# EAGLE design UTDTestBoxMicro (EAGLE 5.06)
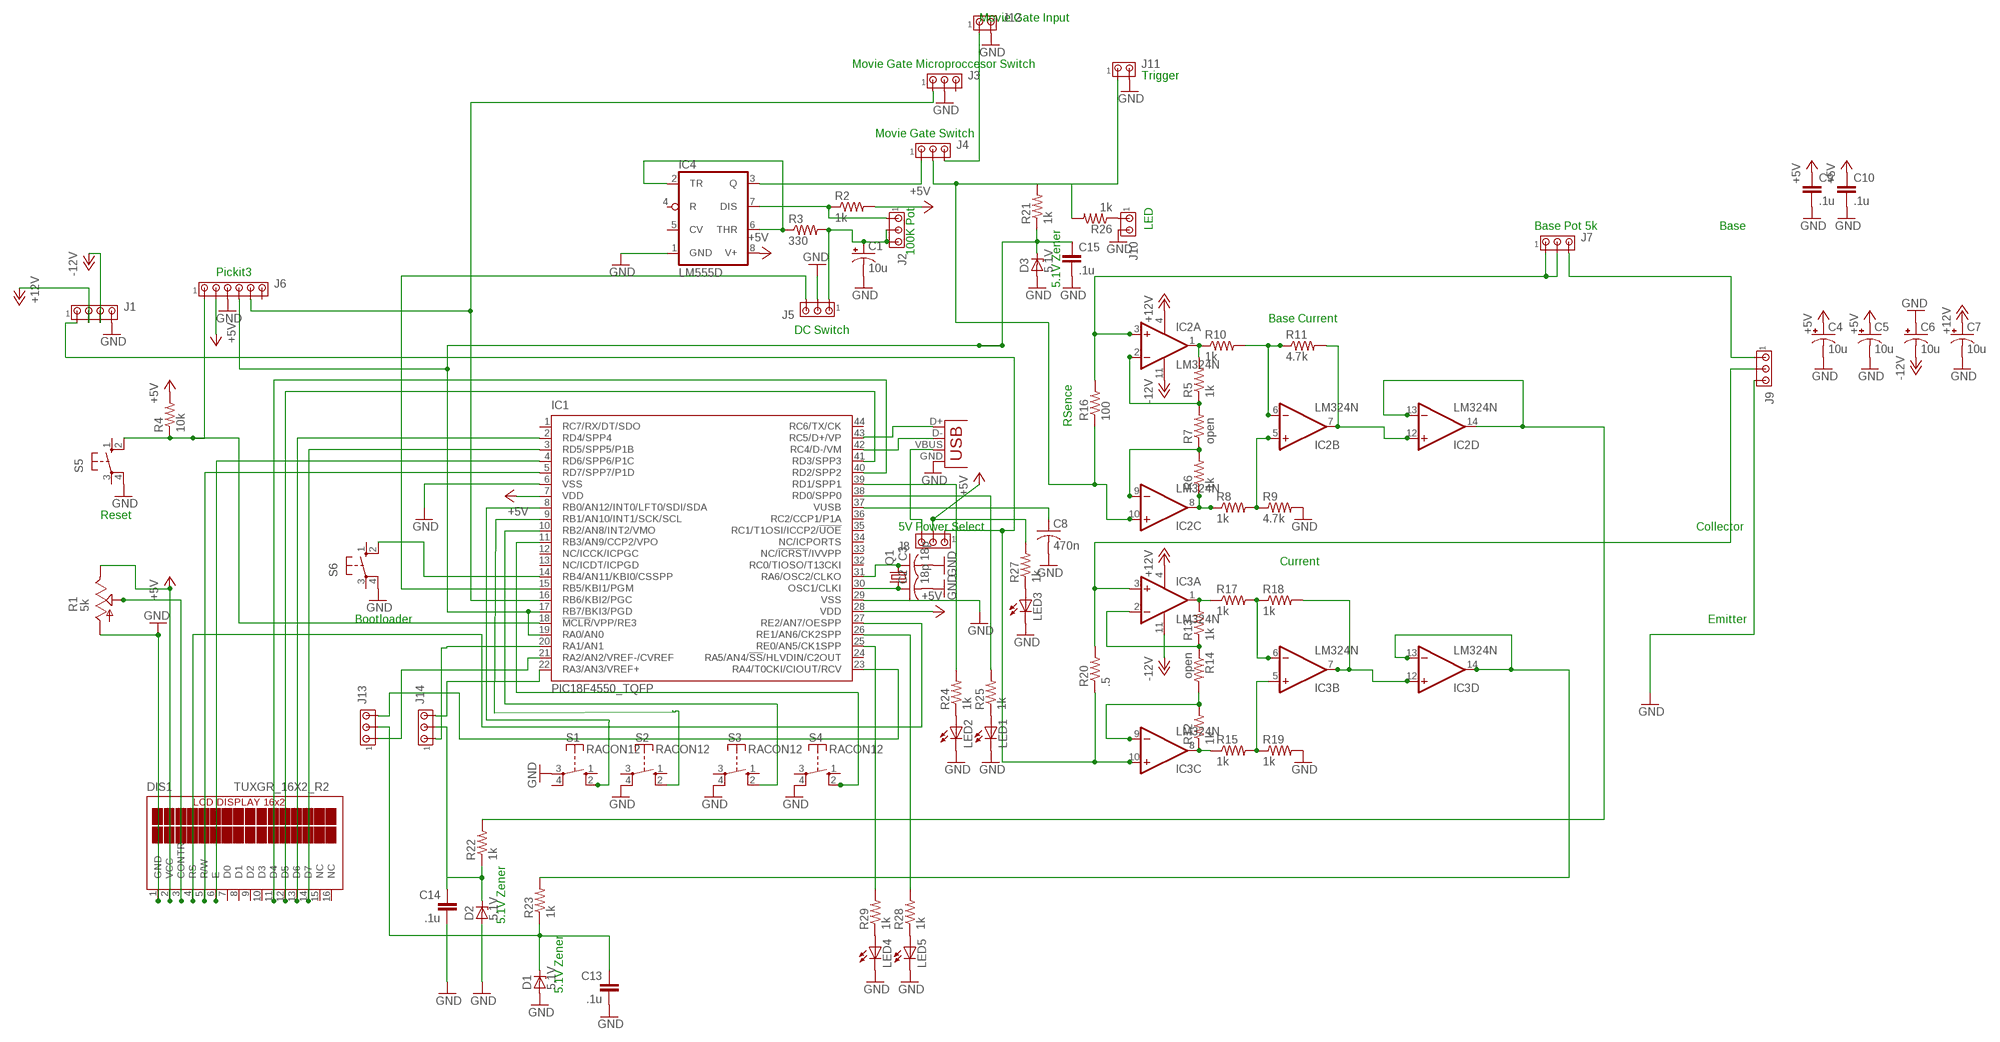
[diagram p0: schematic, sheet 1]

## Parts
C1  10u  CPOL-USE2.5-6  [E2,5-6]
C2  18p  C-USC0805  [C0805]
C3  18p  C-USC0805  [C0805]
C4  10u  CPOL-USE2.5-6  [E2,5-6]
C5  10u  CPOL-USE2.5-6  [E2,5-6]
C6  10u  CPOL-USE2.5-6  [E2,5-6]
C7  10u  CPOL-USE2.5-6  [E2,5-6]
C8  470n  C-USC0805  [C0805]
C9  .1u  C5/3  [C5B3]
C10  .1u  C5/3  [C5B3]
C13  .1u  C5/3  [C5B3]
C14  .1u  C5/3  [C5B3]
C15  .1u  C5/3  [C5B3]
D1  5.1V  ZENER-DIODEDO41Z10  [DO41Z10]
D2  5.1V  ZENER-DIODEDO41Z10  [DO41Z10]
D3  5.1V  ZENER-DIODEDO41Z10  [DO41Z10]
DIS1  TUXGR_16X2_R2  [TUXGR_16X2_R2]
IC1  PIC18F4550_TQFP  [TQFP44]
IC2  LM324N  [DIL14]
IC3  LM324N  [DIL14]
IC4  LM555D  [SO08]
J1  MTA04-156  [1X4MTA]
J2  MTA03-100  [10X03MTA]
J3  MTA03-100  [10X03MTA]
J4  MTA03-100  [10X03MTA]
J5  MTA03-100  [10X03MTA]
J6  MTA06-100  [10X06MTA]
J7  MTA03-100  [10X03MTA]
J8  MTA03-100  [10X03MTA]
J9  MTA03-156  [1X3MTA]
J10  MTA02-100  [10X02MTA]
J11  MTA02-100  [10X02MTA]
J12  MTA02-100  [10X02MTA]
J13  MTA03-100  [10X03MTA]
J14  MTA03-100  [10X03MTA]
LED1  LEDCHIP-LED0805  [CHIP-LED0805]
LED2  LEDCHIP-LED0805  [CHIP-LED0805]
LED3  LEDCHIPLED_0805  [CHIPLED_0805]
LED4  LEDCHIP-LED0805  [CHIP-LED0805]
LED5  LEDCHIP-LED0805  [CHIP-LED0805]
Q1  CRYSTALHC49S  [HC49/S]
R1  5k  TRIM_US-B25U  [B25U]
R2  1k  R-US_R0805  [R0805]
R3  330  R-US_R0805  [R0805]
R4  10k  R-US_M0805  [M0805]
R5  1k  R-US_R0805  [R0805]
R6  1k  R-US_R0805  [R0805]
R7  open  R-US_R0805  [R0805]
R8  1k  R-US_R0805  [R0805]
R9  4.7k  R-US_R0805  [R0805]
R10  1k  R-US_R0805  [R0805]
R11  4.7k  R-US_R0805  [R0805]
R12  1k  R-US_R0805  [R0805]
R13  1k  R-US_R0805  [R0805]
R14  open  R-US_R0805  [R0805]
R15  1k  R-US_R0805  [R0805]
R16  100  R-US_0204/7  [0204/7]
R17  1k  R-US_R0805  [R0805]
R18  1k  R-US_R0805  [R0805]
R19  1k  R-US_R0805  [R0805]
R20  .5  R-US_0204/7  [0204/7]
R21  1k  R-US_R0805  [R0805]
R22  1k  R-US_R0805  [R0805]
R23  1k  R-US_R0805  [R0805]
R24  1k  R-US_R0805  [R0805]
R25  1k  R-US_R0805  [R0805]
R26  1k  R-US_R0805  [R0805]
R27  1k  R-US_R0805  [R0805]
R28  1k  R-US_R0805  [R0805]
R29  1k  R-US_R0805  [R0805]
S1  RACON12  [RACON12]
S2  RACON12  [RACON12]
S3  RACON12  [RACON12]
S4  RACON12  [RACON12]
S5  10-XX  [B3F-10XX]
S6  10-XX  [B3F-10XX]
X1  USBSMD  [USB-MINIB]

## Nets
+5V: C4.+ C5.+ C9.1 C10.1 DIS1.2(VCC) IC1.7(VDD) IC1.28(VDD) IC4.8(V+) J6.5 J8.2 R1.E R2.2 R4.2 R27.2
+12V: C7.+ IC2.4(P:V+) IC3.4(P:V+) J1.2
-12V: C6.- IC2.11(P:V-) IC3.11(P:V-) J1.3
GND: C1.- C2.2 C3.2 C4.- C5.- C6.+ C7.- C8.2 C9.2 C10.2 C13.2 C14.2 C15.2 D1.A D2.A D3.A DIS1.1(GND) IC1.6(VSS) IC1.29(VSS) IC4.1(GND) J1.4 J3.2 J5.2 J6.4 J9.3 J10.2 J11.2 J12.2 LED1.C LED2.C LED3.C LED4.C LED5.C R1.A R9.2 R19.2 S1.3(P) S2.4(P) S3.4(P) S4.4(P) S5.4(P1) S6.4(P1) X1.GND
N$1: DIS1.3(CONTR) R1.S
N$2: IC1.8(RB0/AN12/INT0/LFT0/SDI/SDA) S1.2(S)
N$3: DIS1.4(RS) IC1.27(RE2/AN7/OESPP)
N$4: DIS1.5(R/W) IC1.5(RD7/SPP7/P1D)
N$5: DIS1.6(E) IC1.4(RD6/SPP6/P1C)
N$6: DIS1.14(D7) IC1.3(RD5/SPP5/P1B)
N$7: DIS1.13(D6) IC1.2(RD4/SPP4)
N$8: DIS1.12(D5) IC1.41(RD3/SPP3)
N$9: DIS1.11(D4) IC1.40(RD2/SPP2)
N$10: IC1.9(RB1/AN10/INT1/SCK/SCL) S2.2(S)
N$11: IC1.10(RB2/AN8/INT2/VMO) S3.2(S)
N$12: IC1.11(RB3/AN9/CCP2/VPO) S4.2(S)
N$13: IC4.2(TR) IC4.6(THR) R3.1
N$14: IC4.3(Q) J4.1
N$15: IC4.7(DIS) J2.1 R2.1
N$16: C1.+ J2.2 J2.3 J5.1 R3.2
N$17: C15.1 D3.C IC1.17(RB7/BKI3/PGD) IC1.19(RA0/AN0) J6.3 R21.1
N$18: IC2.8(C:OUT) R6.1 R8.1
N$19: J4.3 J12.1
N$20: IC1.16(RB6/KBI2/PGC) J3.1 J6.2
N$21: IC1.15(RB5/KBI1/PGM) J5.3
N$22: IC1.14(RB4/AN11/KBI0/CSSPP) S6.2(S1)
N$23: IC1.18(!MCLR!/VPP/RE3) J6.6 R4.1 S5.2(S1)
N$24: IC3.8(C:OUT) R12.1 R15.1
N$25: IC2.2(A:-IN) R5.1 R7.2
N$26: IC2.1(A:OUT) R5.2 R10.1
N$27: IC3.1(A:OUT) R13.2 R17.1
N$28: IC3.2(A:-IN) R13.1 R14.1
N$29: C13.1 D1.C J13.2 R23.1
N$30: IC2.9(C:-IN) R6.2 R7.1
N$31: IC2.5(B:+IN) R8.2 R9.1
N$32: IC2.6(B:-IN) R10.2 R11.1
N$33: IC2.7(B:OUT) IC2.12(D:+IN) R11.2
N$34: IC2.13(D:-IN) IC2.14(D:OUT) R22.2
N$35: IC2.3(A:+IN) J7.1 J7.2 R16.2
N$36: J7.3 J9.1
N$37: IC3.10(C:+IN) J1.1 J8.1 R20.1
N$38: IC3.9(C:-IN) R12.2 R14.2
N$39: IC1.20(RA1/AN1) J14.1
N$40: IC3.3(A:+IN) J9.2 R20.2
N$41: IC3.5(B:+IN) R15.2 R19.1
N$42: IC3.6(B:-IN) R17.2 R18.1
N$43: IC3.7(B:OUT) IC3.12(D:+IN) R18.2
N$44: IC3.13(D:-IN) IC3.14(D:OUT) R23.2
N$45: IC1.39(RD1/SPP1) R24.2
N$46: IC2.10(C:+IN) J4.2 J11.1 R16.1 R21.2 R26.2
N$47: IC1.42(RC4/D-/VM) X1.D-
N$48: IC1.43(RC5/D+/VP) X1.D+
N$49: J8.3 X1.VBUS
N$50: IC1.38(RD0/SPP0) R25.2
N$52: LED1.A R25.1
N$53: LED2.A R24.1
N$54: LED3.A R27.1
N$55: LED5.A R28.1
N$56: LED4.A R29.1
N$57: IC1.25(RE0/AN5/CK1SPP) R29.2
N$58: IC1.26(RE1/AN6/CK2SPP) R28.2
N$59: C2.1 IC1.30(OSC1/CLKI) Q1.1
N$60: C3.1 IC1.31(RA6/OSC2/CLKO) Q1.2
N$61: J10.1 R26.1
N$62: C8.1 IC1.37(VUSB)
N$65: IC1.21(RA2/AN2/VREF-/CVREF) J13.1
N$66: IC1.23(RA4/T0CKI/CIOUT/RCV) J13.3
N$67: C14.1 D2.C J14.2 R22.1
N$69: IC1.22(RA3/AN3/VREF+) J14.3
Unconnected: DIS1.7(D0) DIS1.8(D1) DIS1.9(D2) DIS1.10(D3) DIS1.15(NC) DIS1.16(NC) IC1.1(RC7/RX/DT/SDO) IC1.12(NC/ICCK/ICPGC) IC1.13(NC/ICDT/ICPGD) IC1.24(RA5/AN4/!SS!/HLVDIN/C2OUT) IC1.32(RC0/TIOSO/T13CKI) IC1.33(NC/!ICRST!/IVVPP) IC1.34(NC/ICPORTS) IC1.35(RC1/T1OSI/ICCP2/!UOE) IC1.36(RC2/CCP1/P1A) IC1.44(RC6/TX/CK) IC4.4(R) IC4.5(CV) J3.3 J6.1 S1.1(S) S1.4(P) S2.1(S) S2.3(P) S3.1(S) S3.3(P) S4.1(S) S4.3(P) S5.1(S) S5.3(P) S6.1(S) S6.3(P)

## Notes on the sheet
- Movie Gate Input
- Movie Gate Microproccesor Switch
- Trigger
- Movie Gate Switch
- LED | Base Pot 5k | Base
- 100K Pot
- Pickit3
- 5.1V Zener
- Base Current
- DC Switch
- RSence
- Reset
- 5V Power Select | Collector
- Current
- Bootloader | Emitter
- 5.1V Zener
- 5.1V Zener

## Library data of the parts
C1 C4-C7 = resistor:CPOL-US: POLARIZED CAPACITOR, American symbol
C2 C3 C8 = resistor:C-US: CAPACITOR, American symbol
C9 C10 C13-C15 = capacitor-wima:C: CAPACITOR naming: grid - package width
D1-D3 = diode:ZENER-DIODE: Z-Diode
DIS1 = display-lcd:TUXGR_16X2_R2: Tuxgraphics LCD display 16x2 characters reflective, without background light Source: tuxgr_12x2_r2.pdf
IC1 = microchip:PIC18F4*_TQFP: USB Microcontrollers with nanoWatt Technology High-Performance, Enhanced Flash, 28/40/44-Pin, Source: http://ww1.microchip.com/downloads/en/devicedoc/39632c.pdf
IC2 IC3 = linear:LM324: OP AMP
IC4 = linear:*555: TIMER
J1 = con-amp:MTA04-156: AMP connector
J2-J5 J7 J8 J13 J14 = con-amp:MTA03-100: AMP connector
J6 = con-amp:MTA06-100: AMP connector
J9 = con-amp:MTA03-156: AMP connector
J10-J12 = con-amp:MTA02-100: AMP connector
LED1-LED5 = led:LED: LED OSRAM: - CHIPLED LG R971, LG N971, LY N971, LG Q971, LY Q971, LO R971, LY R971 LH N974, LH R974 LS Q976, LO Q976, LY Q976 LO Q996 - Hyper CHIPLED LW Q18S LB Q993, LB Q99A, LB R99A - SideLED LS A670, LO A670, LY A670, LG A670, LP A670 LB A673, LV A673, LT A673, LW A673 LH A674 LY A675 LS A676, LA A676, LO A676, LY A676, LW A676 LS A679, LY A679, LG A679 - Hyper Micro SIDELED® LS Y876, LA Y876, LO Y876, LY Y876 LT Y87S - SmartLED LW L88C, LW L88S LB L89C, LB L89S, LG L890 LS L89K, LO L89K, LY L89K LS L896, LA L896, LO L896, LY L896 - TOPLED LS T670, LO T670, LY T670, LG T670, LP T670 LSG T670, LSP T670, LSY T670, LOP T670, LYG T670 LG T671, LOG T671, LSG T671 LB T673, LV T673, LT T673, LW T673 LH T674 LS T676, LA T676, LO T676, LY T676, LB T676, LH T676, LSB T676, LW T676 LB T67C, LV T67C, LT T67C, LS T67K, LO T67K, LY T67K, LW E67C LS E67B, LA E67B, LO E67B, LY E67B, LB E67C, LV E67C, LT E67C LW T67C LS T679, LY T679, LG T679 LS T770, LO T770, LY T770, LG T770, LP T770 LB T773, LV T773, LT T773, LW T773 LH T774 LS E675, LA E675, LY E675, LS T675 LS T776, LA T776, LO T776, LY T776, LB T776 LHGB T686 LT T68C, LB T68C - Hyper Mini TOPLED® LB M676 - Mini TOPLED Santana® LG M470 LS M47K, LO M47K, LY M47K Source: http://www.osram.convergy.de LUXEON: - LUMILED® LXK2-PW12-R00, LXK2-PW12-S00, LXK2-PW14-U00, LXK2-PW14-V00 LXK2-PM12-R00, LXK2-PM12-S00, LXK2-PM14-U00 LXK2-PE12-Q00, LXK2-PE12-R00, LXK2-PE12-S00, LXK2-PE14-T00, LXK2-PE14-U00 LXK2-PB12-K00, LXK2-PB12-L00, LXK2-PB12-M00, LXK2-PB14-N00, LXK2-PB14-P00, LXK2-PB14-Q00 LXK2-PR12-L00, LXK2-PR12-M00, LXK2-PR14-Q00, LXK2-PR14-R00 LXK2-PD12-Q00, LXK2-PD12-R00, LXK2-PD12-S00 LXK2-PH12-R00, LXK2-PH12-S00 LXK2-PL12-P00, LXK2-PL12-Q00, LXK2-PL12-R00 Source: www.luxeon.com KINGBRIGHT: KA-3528ASYC Source: www.kingbright.com
Q1 = crystal:CRYSTAL: CRYSTAL
R1 = pot:TRIM_US-: POTENTIOMETER
R2-R29 = resistor:R-US_: RESISTOR, American symbol
S1-S4 = switch-misc:RACON12: ITT SWITCH
S5 S6 = switch-omron:10-XX: OMRON SWITCH
X1 = SparkFun:USB: USB Connectors USB-B-PTH is fully proven SKU : PRT-00139 USB-miniB is fully proven SKU : PRT-00587 USB-A-PCB is untested. USB-A-H is throughly reviewed, but untested. Spark Fun Electronics SKU : PRT-00437 USB-B-SMT is throughly reviewed, but untested. Needs silkscreen touching up. USB-A-S has not been used/tested USB-MB-H has not been used/tested

## Board
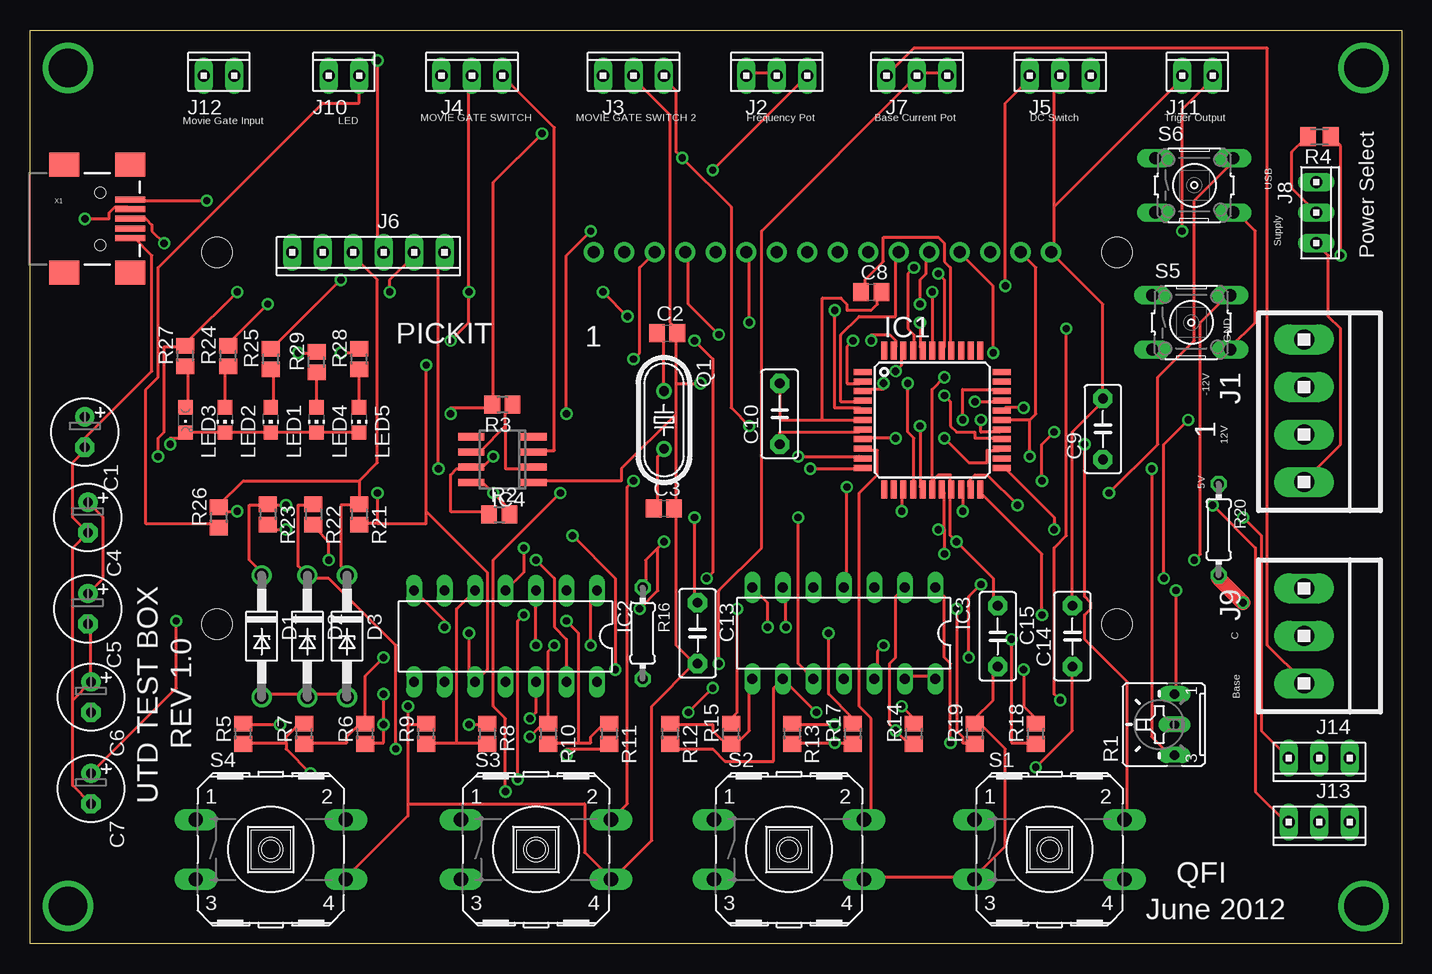
[diagram p1: board, top side]
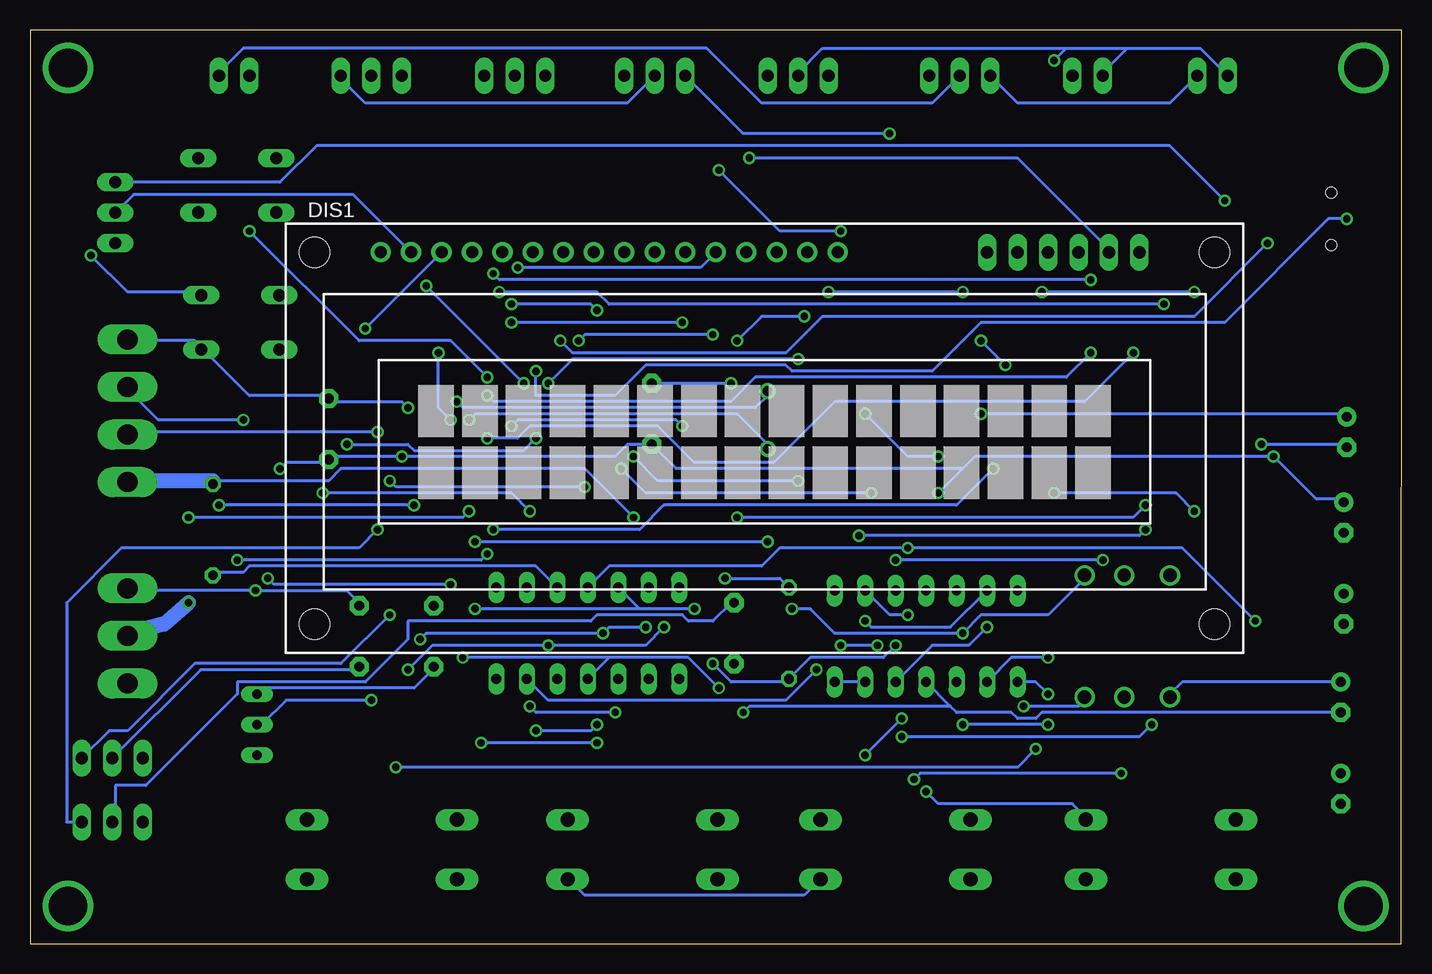
[diagram p2: board, bottom side, seen from below]

Size 114.3 x 76.2 mm. Coordinates in mm from the lower left corner, seen from the top.
Outline: 114.3,0 0.02,0 0,76.2 114.3,76.2 114.3,0
Copper layers (1*16): Top 0.035mm / dielectric 1.5mm / Bottom 0.035mm
Design rules "default": minimum track width 10mil, minimum drill 24mil, track to track 8mil, track to pad 8mil, pad to pad 8mil, via to via 8mil, smd to smd 8mil, copper to edge 40mil, drill to drill 8mil, minimum pad ring 10mil, minimum via ring 8mil, stop-mask expansion 4mil, vias tented up to drill 0mil, thermal gap 10mil

### Footprints (pad centres in the part's own frame; a part is rotated, then mirrored left to right if it is on the bottom)
E2,5-6 = drill 0.813 pad 1.6 round: + -1.27,0 | drill 0.813 pad 1.6 octagon: - 1.27,0
C0805 = smd 1.3 x 1.5: 1 -0.85,0; 2 0.85,0
C5B3 = drill 0.813 pad 1.6 octagon: 1 -2.54,0; 2 2.54,0
DO41Z10 = drill 1.118 round: A 5.08,0; C -5.08,0
TUXGR_16X2_R2 = drill 1 pad 1.676 round: 1 -32,15.5; 2 -29.46,15.5; 3 -26.92,15.5; 4 -24.38,15.5; 5 -21.84,15.5; 6 -19.3,15.5; 7 -16.76,15.5; 8 -14.22,15.5; 9 -11.68,15.5; 10 -9.14,15.5; 11 -6.6,15.5; 12 -4.06,15.5; 13 -1.52,15.5; 14 1.02,15.5; 15 3.56,15.5; 16 6.1,15.5 | hole 2.5: -37.5,-15.5; 37.5,-15.5; -37.5,15.5; 37.5,15.5
TQFP44 = smd 1.5 x 0.5: 1 -5.8,4; 2 -5.8,3.2; 3 -5.8,2.4; 4 -5.8,1.6; 5 -5.8,0.8; 6 -5.8,0; 7 -5.8,-0.8; 8 -5.8,-1.6; 9 -5.8,-2.4; 10 -5.8,-3.2; 11 -5.8,-4; 23 5.8,-4; 24 5.8,-3.2; 25 5.8,-2.4; 26 5.8,-1.6; 27 5.8,-0.8; 28 5.8,0; 29 5.8,0.8; 30 5.8,1.6; 31 5.8,2.4; 32 5.8,3.2; 33 5.8,4 | smd 0.5 x 1.5: 12 -4,-5.8; 13 -3.2,-5.8; 14 -2.4,-5.8; 15 -1.6,-5.8; 16 -0.8,-5.8; 17 0,-5.8; 18 0.8,-5.8; 19 1.6,-5.8; 20 2.4,-5.8; 21 3.2,-5.8; 22 4,-5.8; 34 4,5.8; 35 3.2,5.8; 36 2.4,5.8; 37 1.6,5.8; 38 0.8,5.8; 39 0,5.8; 40 -0.8,5.8; 41 -1.6,5.8; 42 -2.4,5.8; 43 -3.2,5.8; 44 -4,5.8
DIL14 = drill 0.813 long: 1 -7.62,-3.81; 2 -5.08,-3.81; 3 -2.54,-3.81; 4 0,-3.81; 5 2.54,-3.81; 6 5.08,-3.81; 7 7.62,-3.81; 8 7.62,3.81; 9 5.08,3.81; 10 2.54,3.81; 11 0,3.81; 12 -2.54,3.81; 13 -5.08,3.81; 14 -7.62,3.81
SO08 = smd 0.6 x 2.2: 1 -1.905,-2.6; 2 -0.635,-2.6; 3 0.635,-2.6; 4 1.905,-2.6; 5 1.905,2.6; 6 0.635,2.6; 7 -0.635,2.6; 8 -1.905,2.6
1X4MTA = drill 1.676 long: 1 5.944,0; 2 1.981,0; 3 -1.981,0; 4 -5.944,0
10X03MTA = drill 1.016 long: 1 2.54,0; 2 0,0; 3 -2.54,0
10X06MTA = drill 1.016 long: 1 6.35,0; 2 3.81,0; 3 1.27,0; 4 -1.27,0; 5 -3.81,0; 6 -6.35,0
1X3MTA = drill 1.676 long: 1 3.937,0; 2 -0.025,0; 3 -3.988,0
10X02MTA = drill 1.016 long: 1 1.27,0; 2 -1.27,0
CHIP-LED0805 = smd 1.2 x 1.2: A 0,-1.05; C 0,1.05
CHIPLED_0805 = smd 1.2 x 1.2: A 0,-1.05; C 0,1.05
HC49/S = drill 0.813 round: 1 -2.413,0; 2 2.413,0
B25U = drill 0.813 long: A 2.54,-0.889; E -2.54,-0.889; S 0,-0.889
R0805 = smd 1.3 x 1.5: 1 -0.85,0; 2 0.85,0
M0805 = smd 1.3 x 1.6: 1 -0.95,0; 2 0.95,0
0204/7 = drill 0.813 octagon: 1 -3.81,0; 2 3.81,0
RACON12 = drill 1.194 long: 1 -6.248,2.489; 2 6.248,2.489; 3 -6.248,-2.489; 4 6.248,-2.489
B3F-10XX = drill 1.016 long: 1 -3.251,2.261; 2 3.251,2.261; 3 -3.251,-2.261; 4 3.251,-2.261
USB-MINIB = smd 2.5 x 0.5: D+ 2.5,0; D- 2.5,0.8; GND 2.5,-1.6; ID 2.5,-0.8; VBUS 2.5,1.6 | smd 2.5 x 2: MTN1 -3,4.5; MTN2 2.5,4.5; MTN3 -3,-4.5; MTN4 2.5,-4.5 | hole 0.9: 0,2.2; 0,-2.2

### Placement (x,y rotation side)
C1  4.57,42.67 270 top
C2  53.09,50.93 0 top
C3  52.83,36.32 0 top
C4  4.83,35.56 270 top
C5  4.83,27.94 270 top
C6  5.08,20.57 270 top
C7  5.08,12.95 270 top
C8  70.1,54.36 0 top
C9  89.41,42.93 90 top
C10  62.48,44.2 90 top
C13  55.63,25.91 270 top
C14  86.87,25.65 90 top
C15  80.64,25.65 270 top
D1  19.3,25.65 270 top
D2  23.11,25.65 270 top
D3  26.42,25.65 270 top
DIS1  53.09,42.16 0 bottom
IC1  75.18,43.69 0 top
IC2  39.62,25.65 180 top
IC3  67.82,25.91 180 top
IC4  39.37,40.39 90 top
J1  106.17,44.45 270 top
J2  62.23,72.39 0 top
J3  50.29,72.39 0 top
J4  36.83,72.39 0 top
J5  85.85,72.39 0 top
J6  28.19,57.66 180 top
J7  73.91,72.39 0 top
J8  107.19,60.96 270 top
J9  106.17,25.65 270 top
J10  26.16,72.39 0 top
J11  97.28,72.39 0 top
J12  15.75,72.39 0 top
J13  107.44,10.16 180 top
J14  107.44,15.49 180 top
LED1  20.07,43.69 180 top
LED2  16.26,43.69 180 top
LED3  12.95,43.69 180 top
LED4  23.88,43.69 180 top
LED5  27.43,43.69 180 top
Q1  52.83,43.69 270 top
R1  94.49,18.29 90 top
R2  39.12,35.81 0 top
R3  39.37,44.96 180 top
R4  107.44,67.31 180 top
R5  17.78,17.53 90 top
R6  27.94,17.53 90 top
R7  22.86,17.53 90 top
R8  38.1,17.53 270 top
R9  33.02,17.53 90 top
R10  43.18,17.53 270 top
R11  48.26,17.53 270 top
R12  53.34,17.53 270 top
R13  63.5,17.53 270 top
R14  73.66,17.53 90 top
R15  58.42,17.53 90 top
R16  51.05,25.91 270 top
R17  68.58,17.53 90 top
R18  83.82,17.53 90 top
R19  78.74,17.53 90 top
R20  99.06,34.54 270 top
R21  27.43,35.81 270 top
R22  23.62,35.81 270 top
R23  19.81,35.81 270 top
R24  16.51,49.02 90 top
R25  20.07,48.77 90 top
R26  15.75,35.56 90 top
R27  12.95,49.02 90 top
R28  27.43,48.77 90 top
R29  23.88,48.51 90 top
S1  84.96,7.87 0 top
S2  63.25,7.87 0 top
S3  42.16,7.87 0 top
S4  20.07,7.87 0 top
S5  96.77,51.82 0 top
S6  97.03,63.25 0 top
X1  5.84,60.45 0 top

### Tracks (layer width: path | path; a pad name or v marks a point on that pad's centre or on a via)
+5V  (via drill 0.61)
  Top 0.254: J8.2 105.16,62.99 105.16,66.04 106.17,67.06 R4.2 | v83.31,40.64 83.31,43.69 | 83.31,43.69 IC1.28 | v93.47,39.62 93.47,17.27 95,15.75 R1.E | 83.31,43.69 83.82,44.2 83.82,56.39 82.8,57.4 DIS1.2 | C10.1 62.48,42.67 69.09,42.67 IC1.7 | R2.2 39.62,36.07 39.62,36.58 v38.61,37.59 37.59,38.61 37.08,38.61 IC4.8 | v10.67,40.64 10.67,42.16 11.18,42.67 11.18,49.78 12.7,49.78 R27.2 13.21,50.29 v17.27,54.36 | v29.97,54.36 29.97,55.37 32,57.4 J6.5 | C5.+ 6.1,30.48 6.1,35.56 C4.+
  Bottom 0.254: v93.47,39.62 92.96,40.13 89.41,40.13 C9.1 89.41,40.64 v83.31,40.64 65.53,40.64 64.52,41.66 C10.1 60.45,39.62 36.58,39.62 | J8.2 105.66,62.48 87.38,62.48 82.8,57.91 DIS1.2 | C4.+ 5.08,37.08 7.11,37.08 v10.67,40.64 35.56,40.64 36.58,39.62 | v17.27,54.36 v29.97,54.36 | 36.58,39.62 v38.61,37.59
+12V  (via drill 0.61)
  Top 0.254: IC2.4 41.15,30.99 v41.15,33.02 | C7.+ 12.19,21.34 v12.19,26.92 | v85.34,42.67 84.33,41.66 v84.33,38.61 | v68.07,38.1 68.07,29.97 IC3.4
  Bottom 0.254: IC3.4 66.04,31.5 53.34,31.5 51.82,33.02 v41.15,33.02 18.29,33.02 v12.19,26.92 | v85.34,42.67 106.17,42.67 J1.2 | v84.33,38.61 83.82,38.1 v68.07,38.1
-12V  (via drill 0.61)
  Top 0.254: v54.86,19.3 v56.9,21.34 | v96.52,43.69 94.49,41.66 v94.49,30.48 | v79.25,29.97 78.23,28.96 v78.23,23.88
  Bottom 0.254: 37.59,19.81 37.08,19.3 32.51,19.3 32,18.8 30.48,18.8 29.97,19.3 C6.- | 37.59,19.81 IC2.11 | 66.04,23.88 59.44,23.88 v56.9,21.34 | v54.86,19.3 54.36,19.81 37.59,19.81 | 66.04,23.88 IC3.11 | v96.52,43.69 103.63,43.69 106.17,46.23 J1.3 | v94.49,30.48 93.98,29.97 v79.25,29.97 | 66.04,23.88 v78.23,23.88
GND  (via drill 0.61)
  Top 0.254: S2.4 69.6,5.59 78.23,5.59 S1.3 78.74,5.59 81.28,8.13 81.28,16.26 78.74,18.8 | 78.74,18.8 80.26,20.32 80.26,22.86 C15.2 | 78.74,18.8 R19.2 | 85.34,61.47 85.34,57.91 DIS1.1 85.34,57.4 89.41,53.34 C9.2 89.41,45.21 86.87,42.67 C14.2 | 85.34,61.47 85.34,71.63 85.85,72.14 J5.2 | 85.34,61.47 96.01,72.14 J11.2 | S6.4 100.58,60.96 102.11,59.44 102.11,51.82 100.08,49.78 S5.4 | v82.8,44.7 81.28,44.7 IC1.29 | v95.5,29.46 95.5,20.83 R1.A | 16.26,42.67 13.21,42.67 LED3.C 12.7,42.16 11.68,42.16 v11.68,41.66 | 23.88,42.67 20.32,42.67 LED1.C 19.81,42.67 16.26,42.67 | 23.88,42.67 27.43,42.67 LED5.C | 23.88,42.67 LED4.C | 16.26,42.67 LED2.C | X1.GND 8.64,58.93 10.16,57.4 10.16,47.75 4.57,42.16 C1.- 4.57,41.15 3.56,40.13 3.56,35.56 C4.- 3.56,33.02 3.56,20.32 | 31.5,18.29 33.02,18.29 R9.2 | 31.5,11.68 31.5,10.67 26.42,5.59 S4.4 | 31.5,18.29 31.5,11.68 | D1.A 19.3,20.83 22.86,20.83 D2.A 23.37,20.83 26.42,20.83 D3.A | C7.- 3.56,13.21 3.56,20.32 | 3.56,20.32 C6.+ 5.08,26.42 C5.- | v31.5,19.81 31.5,18.29 | v28.96,73.66 28.96,58.42 29.46,57.91 J6.4 | 66.04,43.69 62.48,43.69 C10.2 | 66.04,43.69 IC1.6 | 66.04,43.69 66.04,53.85 67.56,53.85 68.07,53.34 68.07,52.83 70.1,52.83 70.61,53.34 70.61,54.36 C8.2 | 53.85,46.74 53.85,50.8 C2.2 53.85,51.31 53.34,51.82 53.34,69.09 50.29,72.14 J3.2 | 53.85,44.2 53.85,46.74 | 53.85,44.2 53.85,36.58 C3.2 53.85,36.07 53.85,24.89 55.37,23.37 | 53.85,44.2 49.28,39.62 49.28,38.61 42.16,38.61 IC4.1 | 55.37,23.37 51.82,19.81 51.82,8.64 48.77,5.59 S3.4 48.26,5.59 46.23,7.62 46.23,11.68 31.5,11.68 | 55.37,23.37 C13.2 | 53.85,46.74 v55.88,46.74
  Bottom 0.254: R1.A 95,20.83 94.49,21.34 82.3,21.34 80.77,22.86 C15.2 | J1.4 106.17,50.29 100.58,50.29 100.08,49.78 S5.4 99.57,49.28 96.01,45.72 89.41,45.72 C9.2 89.41,45.21 83.31,45.21 v82.8,44.7 | C14.2 86.87,28.45 87.88,29.46 v95.5,29.46 106.17,29.46 J9.3 | v11.68,41.66 4.57,41.66 C1.- | C6.+ 18.29,21.84 19.3,20.83 D1.A | v31.5,19.81 26.92,19.81 26.42,20.32 D3.A | 22.86,74.68 16.76,74.68 J12.2 | 22.86,74.68 24.89,72.64 J10.2 | 27.94,74.68 v28.96,73.66 | 27.94,74.68 22.86,74.68 | 27.94,74.68 48.26,74.68 50.29,72.64 J3.2 | v55.88,46.74 C10.2 | S2.4 69.09,5.08 68.07,4.06 49.78,4.06 48.77,5.08 S3.4
N$1  (via drill 0.61)
  Top 0.254: v85.85,20.32 85.34,20.83 85.34,33.02 86.36,34.04 v86.36,51.31
  Bottom 0.254: v85.85,20.32 92.96,20.32 95,18.29 R1.S | v86.36,51.31 80.26,57.4 DIS1.3
N$2  (via drill 0.61)
  Top 0.254: v72.14,42.16 69.6,42.16 IC1.8 | v87.88,41.66 87.88,28.96 88.39,28.45 88.39,27.94 87.88,27.43 87.88,25.4 91.44,21.84 91.44,10.67 S1.2
  Bottom 0.254: v72.14,42.16 73.15,41.15 82.3,41.15 82.8,41.66 v87.88,41.66
N$3  (via drill 0.61)
  Top 0.254: v79.25,43.69 79.25,42.67 80.77,42.67 IC1.27 | v80.26,49.28 80.26,54.86 77.72,57.4 DIS1.4
  Bottom 0.254: v79.25,43.69 80.26,44.7 v80.26,49.28
N$4  (via drill 0.61)
  Top 0.254: v67.06,52.83 67.06,44.7 69.09,44.7 IC1.5 | v74.17,53.34 74.17,55.37 74.68,55.88 74.68,57.4 DIS1.5
  Bottom 0.254: v67.06,52.83 67.56,53.34 v74.17,53.34
N$5
  Top 0.254: IC1.4 69.09,45.21 67.56,45.21 67.56,50.8 69.09,52.32 72.14,52.32 72.14,57.4 DIS1.6
N$6  (via drill 0.61)
  Top 0.254: v71.12,46.74 71.12,46.23 69.6,46.23 IC1.3 | v50.29,48.77 50.8,49.28 50.8,56.39 51.82,57.4 DIS1.14
  Bottom 0.254: v71.12,46.74 69.09,48.77 v50.29,48.77
N$7  (via drill 0.61)
  Top 0.254: v68.58,50.29 68.07,49.78 68.07,46.74 69.09,46.74 IC1.2 | v57.4,50.8 54.86,53.34 54.86,57.4 DIS1.13
  Bottom 0.254: v68.58,50.29 68.07,50.8 v57.4,50.8
N$8  (via drill 0.61)
  Top 0.254: v73.66,56.39 73.15,55.88 73.15,51.31 73.66,50.8 73.66,49.78 IC1.41
  Bottom 0.254: v73.66,56.39 58.42,56.39 57.4,57.4 DIS1.12
N$9  (via drill 0.61)
  Top 0.254: v74.17,51.82 74.17,49.78 IC1.40 | v59.94,51.82 59.94,57.4 DIS1.11
  Bottom 0.254: v59.94,51.82 v74.17,51.82
N$10
  Top 0.254: IC1.9 69.6,41.15 70.61,41.15 70.61,39.12 69.09,37.59 69.09,19.81 70.1,18.8 70.1,11.18 69.6,10.67 S2.2
N$11  (via drill 0.61)
  Top 0.254: v64.01,40.64 69.09,40.64 IC1.10 | v50.29,38.61 49.78,38.1 49.78,11.68 48.77,10.67 S3.2
  Bottom 0.254: v64.01,40.64 61.98,38.61 v50.29,38.61
N$12  (via drill 0.61)
  Top 0.254: v65.02,39.62 69.09,39.62 IC1.11 | v44.2,37.59 38.61,32 38.61,19.81 39.62,18.8 v39.62,12.7
  Bottom 0.254: v65.02,39.62 62.99,37.59 v44.2,37.59 | v39.62,12.7 38.61,11.68 27.43,11.68 26.42,10.67 S4.2
N$13
  Top 0.254: 39.62,43.18 39.62,44.2 40.13,44.7 R3.1 | 39.62,43.18 37.59,41.15 37.08,41.15 IC4.6 | 39.62,43.18 39.62,39.62 41.66,39.62 IC4.2
N$14
  Top 0.254: IC4.3 42.16,41.15 43.69,41.15 43.69,68.07 J4.1
N$15  (via drill 0.61)
  Top 0.254: R2.1 38.1,36.07 35.05,36.07 35.05,39.12 35.56,39.62 36.58,39.62 IC4.7 37.08,39.62 37.59,39.62 v38.61,40.64 | v46.74,59.44 44.7,57.4 v44.7,44.2 | v56.9,64.52 J2.1
  Bottom 0.254: v56.9,64.52 51.82,59.44 v46.74,59.44 | v44.7,44.2 41.15,40.64 v38.61,40.64
N$16  (via drill 0.61)
  Top 0.254: J2.3 59.94,72.64 61.98,72.64 J2.2 | v35.05,44.2 35.05,44.7 38.1,44.7 R3.2 38.61,45.21 38.61,63.5 v42.67,67.56
  Bottom 0.254: J5.1 88.39,72.14 86.36,70.1 64.52,70.1 J2.2 | v35.05,44.2 4.57,44.2 C1.+ | v42.67,67.56 54.86,67.56 J2.3
N$17  (via drill 0.61)
  Top 0.254: 75.18,38.61 75.69,39.12 76.71,39.12 76.71,38.1 IC1.19 76.71,37.59 76.71,34.04 v77.22,33.53 80.26,30.48 80.26,28.45 C15.1 | 98.55,72.14 96.01,69.6 v96.01,59.44 | v76.2,47.24 75.18,46.23 75.18,38.61 | 75.18,38.61 IC1.17 | 15.75,36.58 17.78,38.61 27.43,38.61 | 27.43,38.61 R21.1 27.43,36.58 25.91,36.58 25.91,31.5 26.42,30.99 D3.C | 27.43,38.61 28.96,40.13 28.96,55.37 26.92,57.4 J6.3 | v36.58,25.91 36.58,22.35 | 52.32,33.02 51.31,32 51.31,29.97 | 52.32,33.02 v52.83,33.53 | v50.8,27.94 52.32,29.46 52.32,33.02
  Bottom 0.254: v96.01,59.44 86.87,50.29 79.25,50.29 v76.2,47.24 | D3.C 26.42,30.48 29.46,27.43 35.05,27.43 v36.58,25.91 47.24,25.91 49.28,27.94 v50.8,27.94 | v52.83,33.53 v77.22,33.53
N$18  (via drill 0.61)
  Top 0.254: v29.46,20.83 v29.46,18.29 29.46,16.76 27.94,16.76 R6.1 | v36.58,18.29 38.1,18.29 R8.1
  Bottom 0.254: v29.46,20.83 30.48,21.84 IC2.8 | v29.46,18.29 v36.58,18.29
N$19
  Bottom 0.254: J12.1 19.3,70.1 32,70.1 J4.3
N$20  (via drill 0.61)
  Top 0.254: v74.17,43.18 74.17,38.1 IC1.16 | v59.94,43.18 58.42,44.7 58.42,61.47 v54.36,65.53 53.85,66.04 53.85,71.12 52.83,72.14 J3.1
  Bottom 0.254: v74.17,43.18 73.66,43.69 60.45,43.69 v59.94,43.18 | v54.36,65.53 32,65.53 24.38,57.91 J6.2
N$21  (via drill 0.61)
  Top 0.254: v73.15,46.74 73.15,42.67 73.66,42.16 73.66,38.1 IC1.15 | v81.28,54.86 81.28,70.1 83.31,72.14 J5.3
  Bottom 0.254: v73.15,46.74 v81.28,54.86
N$22  (via drill 0.61)
  Top 0.254: v72.64,36.07 72.64,37.59 IC1.14 | v89.92,37.59 93.98,41.66 93.98,47.24 97.03,50.29 97.03,61.98 100.08,65.02 S6.2
  Bottom 0.254: v72.64,36.07 74.17,37.59 v89.92,37.59
N$23  (via drill 0.61)
  Top 0.254: 76.2,34.54 v76.2,32.51 | 76.2,34.54 76.2,37.59 IC1.18 | v97.03,32 97.54,32.51 97.54,51.82 99.57,53.85 S5.2 | v109.22,57.4 109.22,66.55 108.71,67.06 R4.1 | v34.04,39.62 34.04,56.9 34.54,57.4 J6.6 | v75.69,34.54 76.2,34.54
  Bottom 0.254: v76.2,32.51 76.71,32 v97.03,32 | v109.22,57.4 106.17,54.36 100.08,54.36 S5.2 | v34.04,39.62 37.08,36.58 61.47,36.58 63.5,34.54 v75.69,34.54
N$24
  Top 0.254: 58.42,16.26 56.9,17.78 56.9,18.29 53.34,18.29 R12.1 | 58.42,16.26 59.94,17.78 59.94,21.84 IC3.8 | 58.42,16.26 R15.1
N$25  (via drill 0.61)
  Top 0.254: 21.34,16.76 17.78,16.76 R5.1 | 21.34,16.76 21.34,17.27 22.86,18.8 R7.2 | v41.15,27.43 40.64,26.92 v40.64,13.72 | v23.37,14.22 21.34,16.26 21.34,16.76
  Bottom 0.254: IC2.2 42.67,27.43 v41.15,27.43 | v40.64,13.72 40.13,14.22 v23.37,14.22
N$26  (via drill 0.61)
  Top 0.254: v20.83,18.29 17.78,18.29 R5.2 | v41.66,17.27 43.18,18.8 | IC2.1 46.74,28.96 v46.74,24.89 | v43.69,24.89 43.18,24.38 43.18,18.8 | 43.18,18.8 R10.1
  Bottom 0.254: v20.83,18.29 21.84,17.27 v41.66,17.27 | v43.69,24.89 v46.74,24.89
N$27  (via drill 0.61)
  Top 0.254: R13.2 63.5,16.76 v67.06,16.76 68.58,16.76 R17.1 | v76.71,16.76 76.71,23.37 76.2,23.88 76.2,28.96 IC3.1
  Bottom 0.254: v67.06,16.76 v76.71,16.76
N$28  (via drill 0.61)
  Top 0.254: v67.06,18.29 63.5,18.29 R13.1 | R14.1 73.66,16.26 v72.14,17.78 71.63,18.29 71.63,23.37 72.14,23.88 72.14,28.96 IC3.2
  Bottom 0.254: v67.06,18.29 67.56,17.78 v72.14,17.78
N$29  (via drill 0.61)
  Top 0.254: 19.81,36.58 18.29,36.58 18.29,32 19.3,30.99 D1.C | 19.81,36.58 v21.34,36.58 | v55.37,35.56 55.37,28.45 C13.1 | 19.81,36.58 R23.1
  Bottom 0.254: J13.2 107.19,10.16 107.19,13.21 104.65,13.21 97.03,20.83 97.03,21.84 86.36,21.84 82.8,25.4 82.8,26.92 67.56,26.92 67.06,27.43 59.94,27.43 59.44,26.92 57.4,26.92 55.88,28.45 C13.1 | v21.34,36.58 22.35,35.56 v55.37,35.56
N$30  (via drill 0.61)
  Top 0.254: 27.94,18.8 26.42,17.27 26.42,16.76 22.86,16.76 R7.1 | v29.46,23.88 27.94,22.35 27.94,18.8 | 27.94,18.8 R6.2
  Bottom 0.254: IC2.9 32.51,23.88 v29.46,23.88
N$31
  Top 0.254: 35.56,16.76 38.1,16.76 R8.2 | 35.56,16.76 33.02,16.76 R9.1 | IC2.5 35.56,27.94 35.56,16.76
N$32  (via drill 0.61)
  Top 0.254: 45.72,16.76 46.74,16.76 46.74,17.27 48.26,18.8 R11.1 | 45.72,16.76 43.18,16.76 R10.2 | v44.7,26.92 45.72,25.91 45.72,16.76
  Bottom 0.254: IC2.6 37.59,26.42 44.2,26.42 v44.7,26.92
N$33  (via drill 0.61)
  Top 0.254: v44.7,15.75 44.7,16.26 48.26,16.26 R11.2 | v41.66,18.8 42.16,19.3 IC2.12 | IC2.7 34.54,26.92 v34.54,26.42
  Bottom 0.254: v41.66,18.8 v44.7,15.75 | v34.54,26.42 36.07,24.89 39.12,24.89 IC2.12
N$34  (via drill 0.61)
  Top 0.254: v24.89,32 24.89,33.53 23.88,34.54 R22.2 | v42.16,32 43.69,30.48 43.69,26.42 44.7,25.4 IC2.13
  Bottom 0.254: v24.89,32 v42.16,32 | IC2.13 IC2.14
N$35  (via drill 0.61)
  Top 0.254: J7.1 76.2,72.64 74.17,72.64 J7.2 60.96,59.44 60.96,33.02 57.4,29.46 v57.4,23.37 | v42.16,24.89 IC2.3
  Bottom 0.254: v42.16,24.89 43.18,23.88 49.28,23.88 R16.2 51.31,21.84 55.88,21.84 v57.4,23.37
N$36
  Top 0.254: J7.3 73.66,74.68 103.12,74.68 103.12,24.89 106.17,21.84 J9.1
N$37  (via drill 0.61)
  Top 0.254: J8.1 108.2,57.4 108.2,52.32 109.22,51.31 109.22,41.66 106.17,38.61 J1.1 | v64.01,35.56 64.01,23.37 IC3.10
  Bottom 0.254: v64.01,35.56 68.07,39.62 88.39,39.62 89.41,38.61 99.06,38.61 R20.1 | 106.17,38.61 J1.1
  Bottom 1.27: 99.06,38.61 106.17,38.61
N$38  (via drill 0.61)
  Top 0.254: R12.2 53.34,16.26 56.9,16.26 57.91,15.24 61.98,15.24 61.98,21.34 IC3.9 v65.53,19.3 | v72.64,19.81 73.66,18.8 R14.2
  Bottom 0.254: v72.64,19.81 72.14,19.3 v65.53,19.3
N$39  (via drill 0.61)
  Top 0.254: v77.72,36.07 77.72,37.59 IC1.20 | v101.09,35.56 102.62,34.04 102.62,17.78 J14.1
  Bottom 0.254: v77.72,36.07 78.23,35.56 v101.09,35.56
N$40  (via drill 0.61)
  Top 0.254: R20.2 99.06,30.48
  Top 1.27: 99.06,30.48 v101.09,28.45
  Bottom 0.254: IC3.3 72.14,31.5 96.01,31.5 96.52,30.99 99.06,30.99 R20.2 | 106.17,25.91 J9.2
  Bottom 1.27: 106.17,25.91 103.12,26.67 v101.09,28.45
N$41  (via drill 0.61)
  Top 0.254: v58.93,27.94 58.93,19.3 58.42,18.8 R15.2 | v77.22,27.94 77.22,17.78 77.72,17.27 77.72,16.76 78.74,16.76 R19.1
  Bottom 0.254: v58.93,27.94 63.5,27.94 | 63.5,27.94 IC3.5 | 63.5,27.94 v77.22,27.94
N$42  (via drill 0.61)
  Top 0.254: v66.55,25.91 66.55,20.83 68.58,18.8 R17.2 | v62.99,26.42 62.99,29.46 IC3.6 | v81.79,25.4 81.79,16.76 83.82,16.76 R18.1
  Bottom 0.254: v62.99,26.42 66.04,26.42 v66.55,25.91 81.28,25.91 v81.79,25.4
N$43  (via drill 0.61)
  Top 0.254: v82.8,22.86 82.8,19.81 83.82,18.8 R18.2 | v71.12,24.89 70.61,24.38 70.61,22.35 IC3.12 | v61.47,26.42 61.47,28.45 IC3.7
  Bottom 0.254: v82.8,22.86 80.77,24.89 v71.12,24.89 62.99,24.89 v61.47,26.42
N$44  (via drill 0.61)
  Top 0.254: v21.34,34.54 19.81,34.54 R23.2 | v45.21,34.04 48.77,30.48 v48.77,22.86 | IC3.14 75.18,22.35 73.15,22.35 IC3.13
  Bottom 0.254: v21.34,34.54 21.84,34.04 v45.21,34.04 | v48.77,22.86 51.31,20.32 71.12,20.32 IC3.13
N$45  (via drill 0.61)
  Top 0.254: v19.81,53.34 16.76,50.29 R24.2 | v75.18,54.36 IC1.39
  Bottom 0.254: v19.81,53.34 66.04,53.34 67.06,54.36 v75.18,54.36
N$46  (via drill 0.61)
  Top 0.254: 28.96,35.05 27.43,35.05 R21.2 | 28.96,35.05 33.02,35.05 33.02,36.07 | 33.02,36.07 v33.02,48.26 | v35.05,50.29 36.58,51.82 v36.58,54.36 36.58,72.14 J4.2 | v17.27,36.07 15.75,36.07 R26.2 | v28.96,37.59 28.96,35.05 | IC2.10 38.1,22.86 38.1,30.99 33.02,36.07 | v56.39,30.48 56.9,30.99 56.9,48.77 v55.37,50.29 | v47.75,54.36 v49.78,52.32
  Bottom 0.254: v33.02,48.26 v35.05,50.29 | v17.27,36.07 18.8,37.59 v28.96,37.59 | v56.39,30.48 51.82,30.48 R16.1 | v55.37,50.29 53.34,52.32 v49.78,52.32 | v36.58,54.36 v47.75,54.36 | J11.1 98.55,72.64 96.52,74.68 57.91,74.68 53.34,70.1 39.12,70.1 J4.2
N$47  (via drill 0.61)
  Top 0.254: v72.14,47.75 72.64,48.26 72.64,49.28 IC1.42 | v4.57,60.45 6.6,60.45 6.6,60.96 7.11,61.47 8.13,61.47 X1.D-
  Bottom 0.254: v72.14,47.75 72.14,45.72 65.53,45.72 62.99,48.26 51.31,48.26 50.8,47.75 39.12,47.75 35.05,51.82 14.73,51.82 6.1,60.45 v4.57,60.45
N$48  (via drill 0.61)
  Top 0.254: v70.1,50.29 70.1,50.8 71.63,50.8 72.14,50.29 72.14,49.78 IC1.43 | v11.18,58.42 10.16,59.44 10.16,59.94 9.65,60.45 X1.D+
  Bottom 0.254: v70.1,50.29 69.09,49.28 51.31,49.28 48.26,52.32 17.27,52.32 v11.18,58.42
N$49  (via drill 0.61)
  Top 0.254: v14.73,61.98 8.64,61.98 X1.VBUS
  Bottom 0.254: v14.73,61.98 19.3,66.55 90.42,66.55 93.47,63.5 J8.3
N$50  (via drill 0.61)
  Top 0.254: v75.69,55.88 76.2,55.37 76.2,49.78 IC1.38 | v25.91,55.37 20.32,49.78 R25.2
  Bottom 0.254: v75.69,55.88 75.18,55.37 v25.91,55.37
N$52
  Top 0.254: LED1.A 20.32,45.21 20.32,47.75 R25.1
N$53
  Top 0.254: LED2.A 16.26,47.75 R24.1
N$54
  Top 0.254: LED3.A 13.21,45.21 13.21,47.75 R27.1
N$55
  Top 0.254: LED5.A R28.1
N$56
  Top 0.254: LED4.A R29.1
N$57  (via drill 0.61)
  Top 0.254: v22.35,49.28 23.88,49.28 R29.2 | v76.2,42.16 78.23,40.13 79.76,40.13 79.76,41.15 80.77,41.15 IC1.25
  Bottom 0.254: v22.35,49.28 26.42,45.21 47.24,45.21 52.32,40.13 58.93,40.13 61.98,43.18 72.64,43.18 73.66,42.16 v76.2,42.16
N$58  (via drill 0.61)
  Top 0.254: v25.91,49.28 27.43,49.28 R28.2 | v76.2,45.72 76.71,45.21 76.71,43.18 77.22,42.67 78.74,42.67 78.74,42.16 80.77,42.16 IC1.26
  Bottom 0.254: v25.91,49.28 27.94,47.24 53.85,47.24 55.88,45.21 75.69,45.21 v76.2,45.72
N$59  (via drill 0.61)
  Top 0.254: C2.1 52.32,50.8 52.83,50.29 Q1.1 | v78.74,45.21 80.77,45.21 IC1.30
  Bottom 0.254: v78.74,45.21 78.23,44.7 53.85,44.7 52.83,45.72 Q1.1
N$60  (via drill 0.61)
  Top 0.254: C3.1 52.32,36.58 52.32,40.64 52.83,41.15 Q1.2 | v77.72,43.69 77.72,46.23 80.77,46.23 IC1.31
  Bottom 0.254: v77.72,43.69 77.22,44.2 55.37,44.2 52.83,41.66 Q1.2
N$61
  Top 0.254: R26.1 15.75,35.05 9.65,35.05 9.65,46.23 10.67,47.24 10.67,56.39 24.38,70.1 27.43,70.1 J10.1
N$62
  Top 0.254: IC1.37 76.71,49.78 76.71,56.39 76.2,56.9 76.2,58.42 75.69,58.93 71.12,58.93 71.12,56.9 69.6,55.37 69.6,54.36 C8.1
N$65  (via drill 0.61)
  Top 0.254: v82.3,36.58 79.76,39.12 78.74,39.12 78.23,38.61 78.23,38.1 IC1.21 | v98.55,36.58 102.11,33.02 102.11,12.7 104.65,10.16 J13.1
  Bottom 0.254: v82.3,36.58 v98.55,36.58
N$66  (via drill 0.61)
  Top 0.254: v85.34,34.54 85.34,35.56 81.28,39.62 IC1.23
  Bottom 0.254: v85.34,34.54 86.87,33.02 106.68,33.02 111.25,28.45 111.25,10.16 J13.3
N$67  (via drill 0.61)
  Top 0.254: R22.1 23.37,36.58 22.35,36.58 22.35,31.5 D2.C 23.37,30.48 24.89,30.48 30.48,24.89 v30.48,16.26 | v83.82,14.73 86.87,17.78 C14.1
  Bottom 0.254: J14.2 100.08,22.86 86.87,22.86 C14.1 | v30.48,16.26 32,14.73 v83.82,14.73
N$68  (via drill 3.2)
  other vias: 3.17,3.17
N$69  (via drill 0.61)
  Top 0.254: v84.33,27.43 84.33,32.51 79.25,37.59 IC1.22
  Bottom 0.254: v84.33,27.43 88.39,23.37 100.58,23.37 106.17,17.78 107.7,17.78 J14.3
N$70  (via drill 3.2)
  other vias: 111.12,3.17
N$71  (via drill 3.2)
  other vias: 111.12,73.03
N$72  (via drill 3.2)
  other vias: 3.17,73.03

### Text on the board
tNames: MOVIE GATE SWITCH | MOVIE GATE SWITCH 2 | Frequency Pot | Base Current Pot | DC Switch | Triger Output | Movie Gate Input | LED | USB | Supply | Power Select | PICKIT | 1 | GND | -12V | 1 | 12V | 5V | C | Base | REV 1.0 | UTD TEST BOX | QFI | June 2012 | E